# EAGLE design esp8266_wio73_breakout (EAGLE 6.5.0)
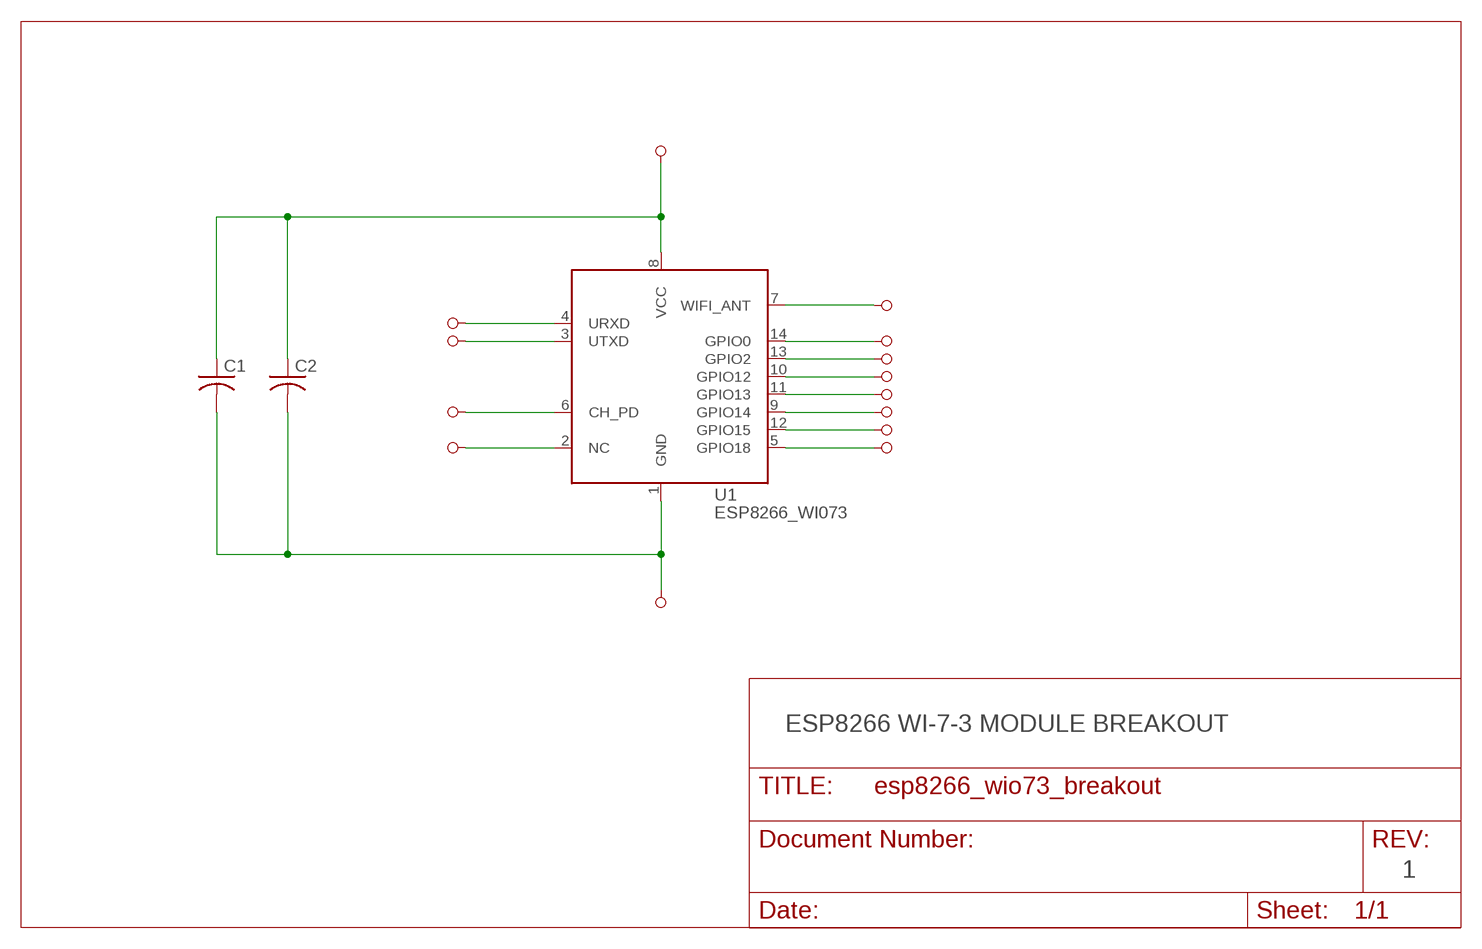
[diagram p0: schematic, sheet 1]

## Parts
C1  CAPACITORC0603K  [C0603K]
C2  CAPACITORC0603K  [C0603K]
TP1  PINHD-1X1-FIRST  [1X01_FIRST]
TP2  PINHD-1X1  [1X01]
TP3  PINHD-1X1  [1X01]
TP4  PINHD-1X1  [1X01]
TP5  PINHD-1X1  [1X01]
TP6  PINHD-1X1  [1X01]
TP7  PINHD-1X1  [1X01]
TP8  PINHD-1X1  [1X01]
TP9  PINHD-1X1  [1X01]
TP10  PINHD-1X1  [1X01]
TP11  PINHD-1X1  [1X01]
TP12  PINHD-1X1  [1X01]
TP13  PINHD-1X1  [1X01]
TP14  PINHD-1X1  [1X01]
U1  ESP8266_WI073  [ESP8266_WI073]

## Nets
GND: C1.2 C2.2 TP1.1 U1.1(GND)
N$1: TP4.1 U1.4(URXD)
N$2: TP3.1 U1.3(UTXD)
N$3: TP6.1 U1.6(CH_PD)
N$4: TP2.1 U1.2(NC)
N$5: TP7.1 U1.7(WIFI_ANT)
N$6: TP14.1 U1.14(GPIO0)
N$7: TP13.1 U1.13(GPIO2)
N$8: TP10.1 U1.10(GPIO12)
N$9: TP11.1 U1.11(GPIO13)
N$10: TP9.1 U1.9(GPIO14)
N$11: TP12.1 U1.12(GPIO15)
N$12: TP5.1 U1.5(GPIO18)
VCC: C1.1 C2.1 TP8.1 U1.8(VCC)

## Notes on the sheet
- ESP8266 WI-7-3 MODULE BREAKOUT
- 1

## Library data of the parts
C1 C2 = arm-pro-mini:CAPACITOR: CAPACITOR, American symbol
TP1 = esp8266_wio73_breakout:PINHD-1X1-FIRST
TP2-TP14 = ltc2943_breakout:PINHD-1X1: PIN HEADER
U1 = esp8266_wio73_breakout:ESP8266_WI073

## Net classes
1 power: width 0.254 mm

## Board
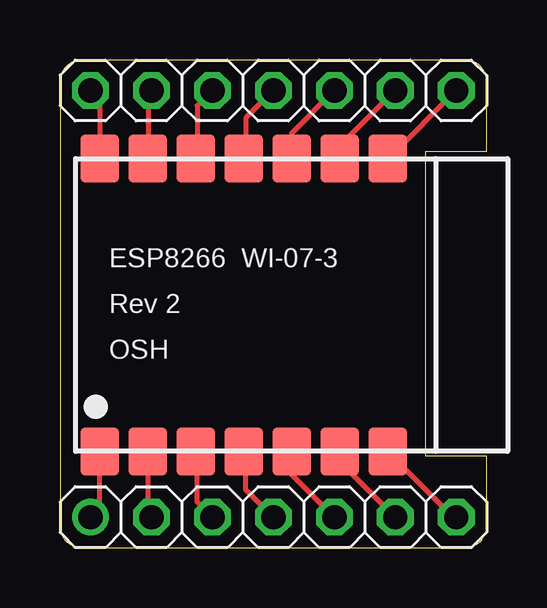
[diagram p1: board, top side]
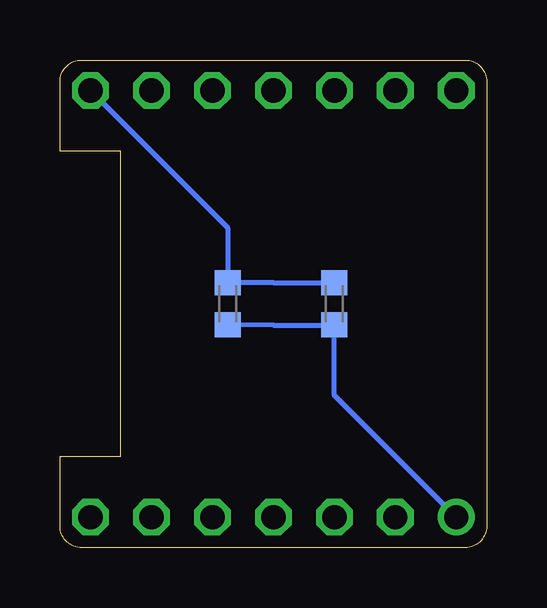
[diagram p2: board, bottom side, seen from below]

Size 17.78 x 20.32 mm. Coordinates in mm from the lower left corner, seen from the top.
Outline: 0,19.42 0,0.9 arc90 0.9,0 16.88,0 arc90 17.78,0.9 17.78,3.81 15.24,3.81 15.24,16.51 17.78,16.51 17.78,19.42 arc90 16.88,20.32 0.9,20.32 arc90 0,19.42
Copper layers (1*16): Top 0.035mm / dielectric 1.5mm / Bottom 0.035mm
Design rules "default *": minimum track width 8mil, minimum drill 13mil, track to track 8mil, track to pad 8mil, pad to pad 8mil, via to via 8mil, smd to smd 8mil, copper to edge 15mil, drill to drill 8mil, minimum pad ring 10mil, minimum via ring 8mil, stop-mask expansion 4mil, vias tented up to drill 20mil, thermal gap 10mil

### Footprints (pad centres in the part's own frame; a part is rotated, then mirrored left to right if it is on the bottom)
C0603K = smd 1.05 x 1.08: 1 -0.875,0; 2 0.875,0
1X01_FIRST = drill 1.016: 1 0,0
1X01 = drill 1.016 octagon: 1 0,0
ESP8266_WI073 = smd 1.6 x 2: 1 0,0; 2 2,0; 3 4,0; 4 6,0; 5 8,0; 6 10,0; 7 12,0; 8 12,12.2; 9 10,12.2; 10 8,12.2; 11 6,12.2; 12 4,12.2; 13 2,12.2; 14 0,12.2

### Placement (x,y rotation side)
C1  10.79,10.16 270 bottom
C2  6.35,10.16 270 bottom
TP1  1.27,1.27 0 top
TP2  3.81,1.27 0 top
TP3  6.35,1.27 0 top
TP4  8.89,1.27 0 top
TP5  11.43,1.27 0 top
TP6  13.97,1.27 0 top
TP7  16.51,1.27 0 top
TP8  16.51,19.05 0 top
TP9  13.97,19.05 0 top
TP10  11.43,19.05 0 top
TP11  8.89,19.05 0 top
TP12  6.35,19.05 0 top
TP13  3.81,19.05 0 top
TP14  1.27,19.05 0 top
U1  1.65,4.01 0 top

### Tracks (layer width: path | path; a pad name or v marks a point on that pad's centre or on a via)
GND
  Top 0.203: U1.1 1.65,1.65 TP1.1
  Bottom 0.203: C2.2 8.89,9.27 C1.2 | C2.2 6.35,6.35 TP1.1 | C2.2
N$1
  Top 0.203: TP4.1 7.75,2.41 7.75,3.94 U1.4
N$2
  Top 0.203: TP3.1 5.71,1.9 5.71,3.94 U1.3
N$3
  Top 0.203: TP6.1 11.68,3.56 11.68,3.94 U1.6
N$4
  Top 0.203: TP2.1 3.68,1.4 3.68,3.94 U1.2
N$5
  Top 0.203: TP7.1 16.38,1.27 13.72,3.94 U1.7
N$6
  Top 0.203: U1.14 1.65,18.67 TP14.1
N$7
  Top 0.203: TP13.1 3.68,18.92 3.68,16.26 U1.13
N$8
  Top 0.203: TP10.1 9.65,17.27 9.65,16.26 U1.10
N$9
  Top 0.203: TP11.1 7.75,17.91 7.75,16.26 U1.11
N$10
  Top 0.203: TP9.1 11.68,16.76 11.68,16.26 U1.9
N$11
  Top 0.203: TP12.1 5.71,18.41 5.71,16.26 U1.12
N$12
  Top 0.203: TP5.1 9.65,3.05 9.65,3.94 U1.5
VCC
  Top 0.203: TP8.1 13.72,16.26 U1.8
  Bottom 0.203: C2.1 6.35,11.05 8.89,11.05 C1.1 10.79,13.34 TP8.1

### Text on the board
tPlace: ESP8266 WI-07-3 | Rev 2 | OSH